# Altium schematic sheet BlockschaltbildV4.SchDoc: Blockschaltbild - Bointner, Macsek
size A4
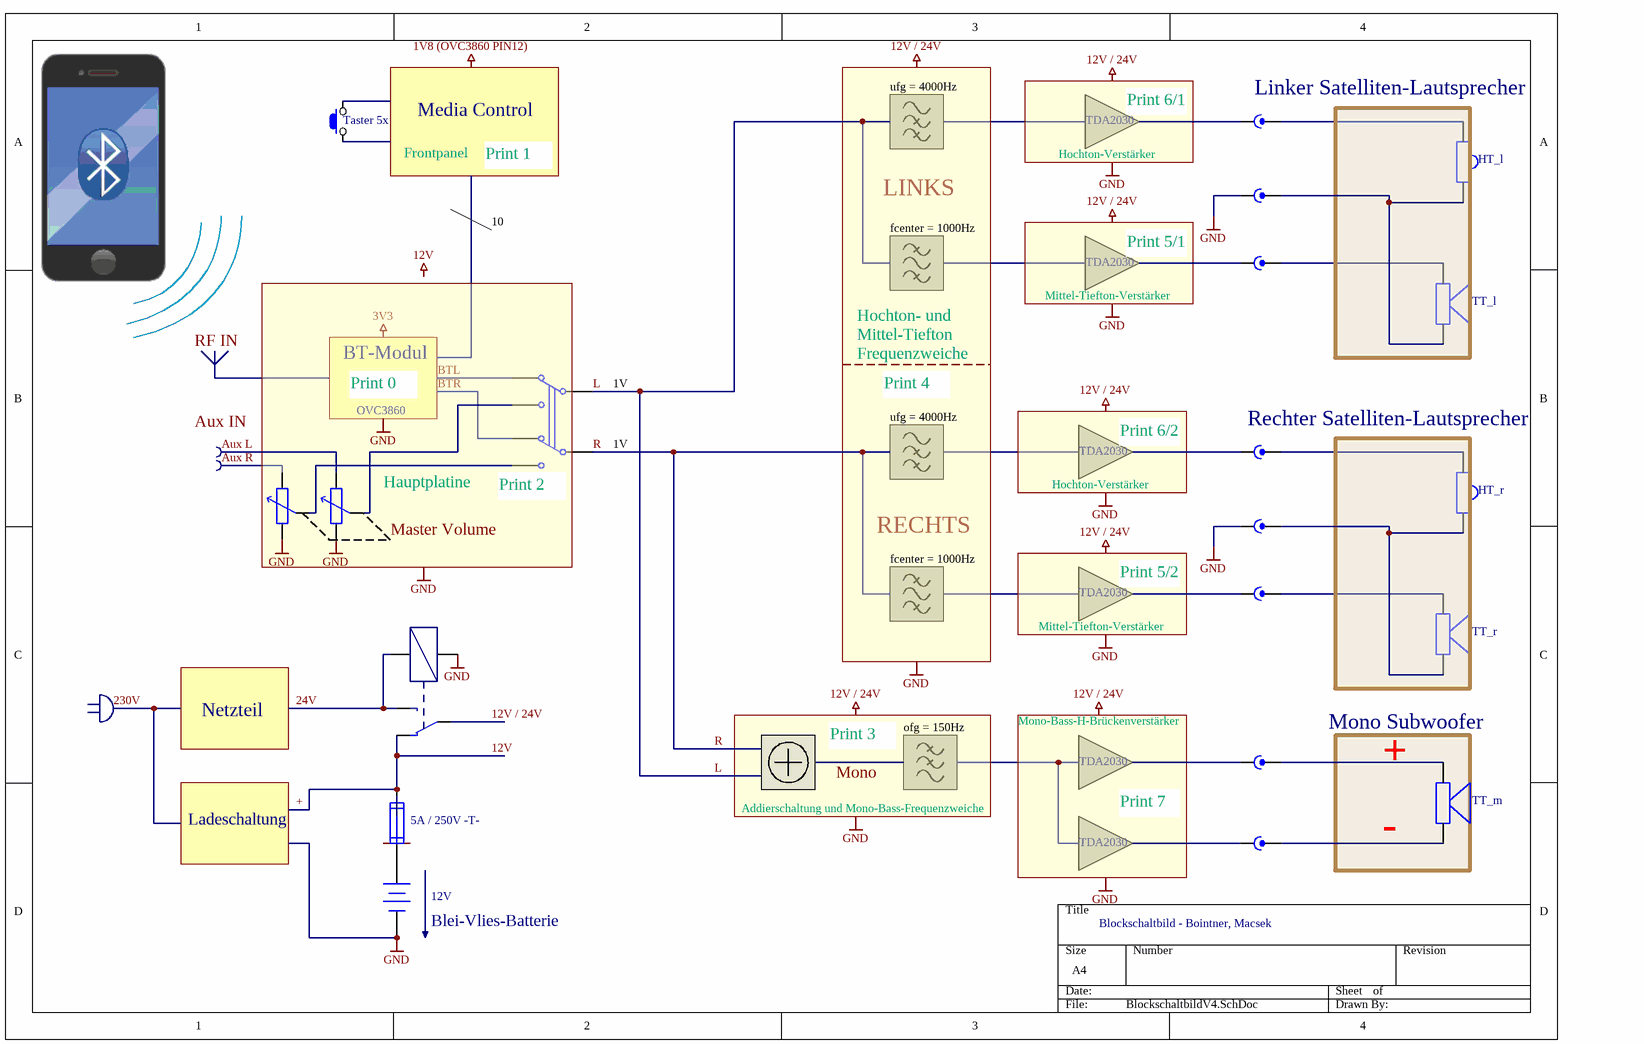
[diagram p0: BlockschaltbildV4.SchDoc]

## Parts
1  Bandpass  (value not drawn)
2  Hochpass (3)  (value not drawn)
3  Tiefpass (3)  (value not drawn)
4  Buchse  (value not drawn)
5  TDA2030
6  TDA2030
7  Buchse  (value not drawn)
8  Buchse  (value not drawn)
9  Buchse  (value not drawn)
10  Buchse  (value not drawn)
11  Buchse  (value not drawn)
33  TDA2030
44  TDA2030
123  Hochpass (3)  (value not drawn)
3333  TDA2030
4444  TDA2030
123123  Buchse  (value not drawn)
131231  Buchse  (value not drawn)
*  Addierer  (value not drawn)
*1  Bandpass  (value not drawn)
BT1  Blei-Vlies-Batterie  [BAT-2]  (value not drawn)
HT_l  Hochtöner  (value not drawn)
HT_r  Hochtöner  (value not drawn)
R  Stereo_POT  [Stereo_POT]  (value not drawn)  (parts A,B of 2)
Rel1  AZ845  [DIP-10]  (value not drawn)  (part B of 3)
Relai  Relai  (value not drawn)
S1  SW-SPDT  [TL36WW15050]  (value not drawn)
S2  SW-SPDT  [TL36WW15050]  (value not drawn)
S?  5A / 250V -T-  [SICHERUNG]
T?  Taster 5x  [Tast]
TT_l  Laustprecher  (value not drawn)
TT_m  Laustprecher  (value not drawn)
TT_r  Laustprecher  (value not drawn)

## Blocks framed on the sheet
Hochton-Verstärker: 5
Mittel-Tiefton-Verstärker: 6
BT-Modul: R S1 S2
Hochton-Verstärker: 33
Mittel-Tiefton-Verstärker: 44
Addierschaltung und Mono-Bass-Frequenzweiche: 3 *
Mono-Bass-H-Brückenverstärker: 3333 4444

## Nets
12V / 24V: Rel1.3
+: Rel1.2 S?.2  [also labelled 12V]
GND: 10.0 11.0 BT1.2(-) R.1 R.4 Relai.1
1V: S1.2 S2.2  [also labelled L, R]
24V: Rel1.4 Relai.2
Aux L: R.6
Aux R: R.3
BTL: S1.3
BTR: S2.3
Net4_1: 4.1 TT_r.2
Net7_1: 7.1 TT_m.2
Net8_1: 8.1 HT_r.2
Net9_1: 9.1 TT_m.1
Net10_1: 10.1 HT_r.1 TT_r.1
Net11_1: 11.1 HT_l.1 TT_l.1
Net123123_1: 123123.1 TT_l.2
Net131231_1: 131231.1 HT_l.2
NetBT1_1: BT1.1(+) S?.1
NetR_2: R.2 S2.1
NetR_5: R.5 S1.1

Not connected (* = marked no-connect by the designer): 4 0; 7 0; 8 0; 9 0; 123123 0; 131231 0; T? 1 2

## Notes on the sheet
- Media Control
- Print 6/1
- (near 131231) Linker Satelliten-Lautsprecher
- Frontpanel
- Print 1
- Print 5/1
- Print 0
- (near 1) Hochton- und Mittel-Tiefton
  Frequenzweiche
- Print 4
- OVC3860
- Print 6/2
- (near 8) Rechter Satelliten-Lautsprecher
- Hauptplatine
- (near S2) Print 2
- Print 5/2
- Netzteil
- (near 3) Print 3
- Mono Subwoofer
- Ladeschaltung
- (near 3333) Print 7
- (near BT1) 12V
- Blockschaltbild - Bointner, Macsek
- Labels drawn without touching a wire or pin: 1V8 (OVC3860 PIN12), 3V3, 10, 12V, 12V / 24V, +, -, Aux IN, Blei-Vlies-Batterie, fcenter = 1000Hz, GND, LINKS, Master Volume, Mono, ofg = 150Hz, RECHTS, RF IN, ufg = 4000Hz

## Library data of the parts
5 6 33 44 3333 4444 = Verstärker
BT1 = Battery: Multicell Battery; Published: 24-Mar-1999; LatestRevisionDate: 17-Jul-2002; LatestRevisionNote: Re-released for DXP Platform.; PackageReference: BAT-2; Publisher: Altium Limited; PackageDescription: Battery; 2 Leads
Rel1 = Relais
S1 S2 = SW-SPDT: SPDT Subminiature Toggle Switch, Right Angle Mounting, Vertical Actuation; Published: 24-Mar-1999; LatestRevisionDate: 17-Dec-2003; LatestRevisionNote: Schematic revised, PCB Footprint replaced.; DatasheetVersion: 05-Dec-2000; PackageReference: TL36WW15050; Publisher: Altium Limited; PackageDescription: Switch; 4 Leads; ComponentLink1Description: Manufacturer Link; ComponentLink1URL: http://www.apem.com
S? = SICHERUNG: Text Field1: Strom
T? = Taster